# EAGLE design AVR-Timer_smd (EAGLE 7.4.0)
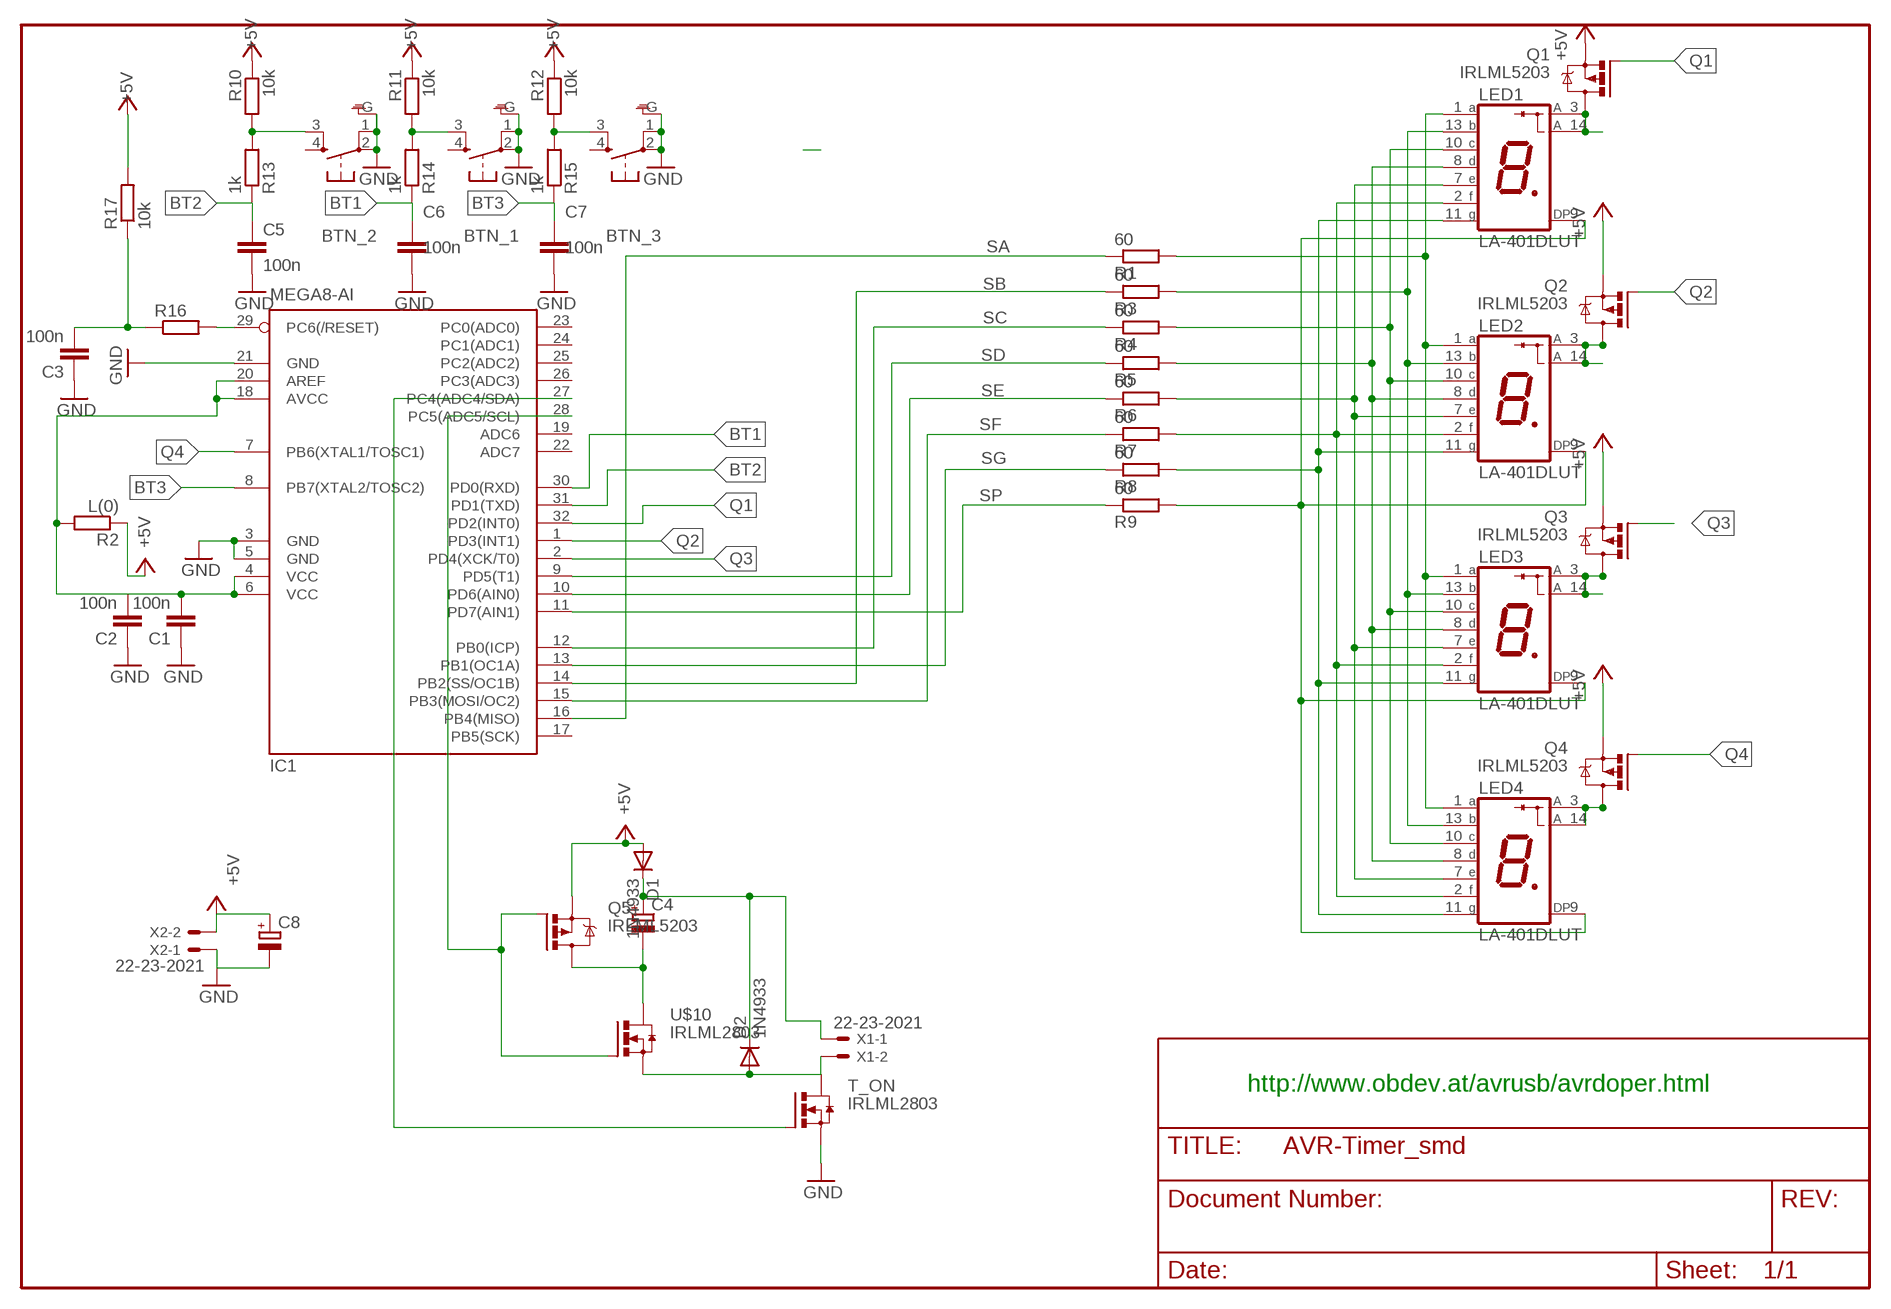
[diagram p0: schematic, sheet 1]

## Parts
BTN_1  10-XXG  [B3F-10XXG]
BTN_2  10-XXG  [B3F-10XXG]
BTN_3  10-XXG  [B3F-10XXG]
C1  100n  C-EUC0805K  [C0805K]
C2  100n  C-EUC0805K  [C0805K]
C3  100n  C-EUC0805K  [C0805K]
C4  CPOL-EUE5-8.5  [E5-8,5]
C5  100n  C-EUC0805K  [C0805K]
C6  100n  C-EUC0805K  [C0805K]
C7  100n  C-EUC0805K  [C0805K]
C8  CPOL-EUE5-8.5  [E5-8,5]
D1  1N4933  [DO41-10]
D2  1N4933  [DO41-10]
IC1  MEGA8-AI  [TQFP32-08]
LED1  LA-401DLUT  [MY_LUT]
LED2  LA-401DLUT  [MY_LUT]
LED3  LA-401DLUT  [MY_LUT]
LED4  LA-401DLUT  [MY_LUT]
Q1  IRLML5203  [MICRO3]
Q2  IRLML5203  [MICRO3]
Q3  IRLML5203  [MICRO3]
Q4  IRLML5203  [MICRO3]
Q5  IRLML5203  [MICRO3]
R1  60  R-EU_M0805  [M0805]
R2  L(0)  R-EU_M1206  [M1206]
R3  60  R-EU_M0805  [M0805]
R4  60  R-EU_M0805  [M0805]
R5  60  R-EU_M0805  [M0805]
R6  60  R-EU_M0805  [M0805]
R7  60  R-EU_M0805  [M0805]
R8  60  R-EU_M0805  [M0805]
R9  60  R-EU_M0805  [M0805]
R10  10k  R-EU_M0805  [M0805]
R11  10k  R-EU_M0805  [M0805]
R12  10k  R-EU_M0805  [M0805]
R13  1k  R-EU_M0805  [M0805]
R14  1k  R-EU_M0805  [M0805]
R15  1k  R-EU_M0805  [M0805]
R16  R-EU_M1206  [M1206]
R17  10k  R-EU_M1206  [M1206]
T_ON  IRLML2803  [SUPER-SOT3]
U$10  IRLML2803  [SUPER-SOT3]
X1  22-23-2021  [22-23-2021]
X2  22-23-2021  [22-23-2021]

## Nets
+5V: C8.+ D1.A Q1.2(S) Q2.2(S) Q3.2(S) Q4.2(S) Q5.2(S) R2.1 R10.1 R11.1 R12.1 R17.2 X2.2
BT1: C6.1 IC1.30(PD0(RXD)) R14.1
BT2: C5.1 IC1.31(PD1(TXD)) R13.1
BT3: C7.1 IC1.8(PB7(XTAL2/TOSC2)) R15.1
GND: BTN_1.1 BTN_1.2(P) BTN_1.G(GND) BTN_2.1 BTN_2.2(P) BTN_2.G(GND) BTN_3.1 BTN_3.2(P) BTN_3.G(GND) C1.1 C2.1 C3.1 C5.2 C6.2 C7.2 C8.- IC1.3(GND) IC1.5(GND) IC1.21(GND) T_ON.2(S) X2.1
N$3: C1.2 C2.2 IC1.4(VCC) IC1.6(VCC) IC1.18(AVCC) IC1.20(AREF) R2.2
N$5: BTN_2.3(S1) R10.2 R13.2
N$6: BTN_1.3(S1) R11.2 R14.2
N$7: BTN_3.3(S1) R12.2 R15.2
N$8: C3.2 R16.1 R17.1
N$9: LED1.1(A) LED2.1(A) LED3.1(A) LED4.1(A) R1.2
N$10: LED1.13(B) LED2.13(B) LED3.13(B) LED4.13(B) R3.2
N$11: LED1.10(C) LED2.10(C) LED3.10(C) LED4.10(C) R4.2
N$12: LED1.8(D) LED2.8(D) LED3.8(D) LED4.8(D) R5.2
N$13: LED1.7(E) LED2.7(E) LED3.7(E) LED4.7(E) R6.2
N$14: LED1.9(DP) LED2.9(DP) LED3.9(DP) LED4.9(DP) R9.2
N$15: LED1.11(G) LED2.11(G) LED3.11(G) LED4.11(G) R8.2
N$16: LED3.3(A) LED3.14(A) Q3.3(D)
N$17: LED2.3(A) LED2.14(A) Q2.3(D)
N$18: LED4.3(A) LED4.14(A) Q4.3(D)
N$19: LED1.2(F) LED2.2(F) LED3.2(F) LED4.2(F) R7.2
N$20: LED1.3(A) LED1.14(A) Q1.3(D)
N$21: C4.- Q5.3(D) U$10.3(D)
N$22: IC1.28(PC5(ADC5/SCL)) Q5.1(G) U$10.1(G)
N$23: D2.A T_ON.3(D) U$10.2(S) X1.2
N$24: C4.+ D1.C D2.C X1.1
N$25: IC1.27(PC4(ADC4/SDA)) T_ON.1(G)
Q1: IC1.32(PD2(INT0)) Q1.1(G)
Q2: IC1.1(PD3(INT1)) Q2.1(G)
Q3: IC1.2(PD4(XCK/T0)) Q3.1(G)
Q4: IC1.7(PB6(XTAL1/TOSC1)) Q4.1(G)
RESET: IC1.29(PC6(/RESET)) R16.2
SA: IC1.16(PB4(MISO)) R1.1
SB: IC1.14(PB2(SS/OC1B)) R3.1
SC: IC1.12(PB0(ICP)) R4.1
SD: IC1.9(PD5(T1)) R5.1
SE: IC1.10(PD6(AIN0)) R6.1
SF: IC1.15(PB3(MOSI/OC2)) R7.1
SG: IC1.13(PB1(OC1A)) R8.1
SP: IC1.11(PD7(AIN1)) R9.1
Unconnected: BTN_1.4(S) BTN_2.4(S) BTN_3.4(S) IC1.17(PB5(SCK)) IC1.19(ADC6) IC1.22(ADC7) IC1.23(PC0(ADC0)) IC1.24(PC1(ADC1)) IC1.25(PC2(ADC2)) IC1.26(PC3(ADC3))

## Notes on the sheet
- http://www.obdev.at/avrusb/avrdoper.html

## Library data of the parts
BTN_1-BTN_3 = switch-omron:10-XXG
C1-C3 C5-C7 = resistor:C-EU: CAPACITOR, European symbol
C4 C8 = resistor:CPOL-EU: POLARIZED CAPACITOR, European symbol
D1 D2 = diode:1N4933: DIODE fast recovery rectifier, 1A
IC1 = atmel:MEGA8: MICROCONTROLLER 8 Kbytes FLASH, 1 kbytes SRAM, 512 bytes EEPROM, USART, 6-channel 10 bit ADC, 2-channel 8 bit ADC Pin compatible with Atmega48, ATMega88, ATMega168 Source: avr.lbr
LED1-LED4 = led-7-segment_my:LA-401*D: Single Digit LED Numeric Display (anode common) Source: ROHM .. la-1401dn.pdf
Q1-Q5 = transistor-power:IRLML5203: HEXFET P-Channel Power MOSFET
R1-R17 = resistor:R-EU_: RESISTOR, European symbol
T_ON U$10 = transistor-power:IRLML2803
X1 X2 = con-molex:22-23-2021: .100" (2.54mm) Center Header - 2 Pin; MF: MOLEX; MPN: 22-23-2021; OC_FARNELL: 1462926; OC_NEWARK: 25C3832

## Board
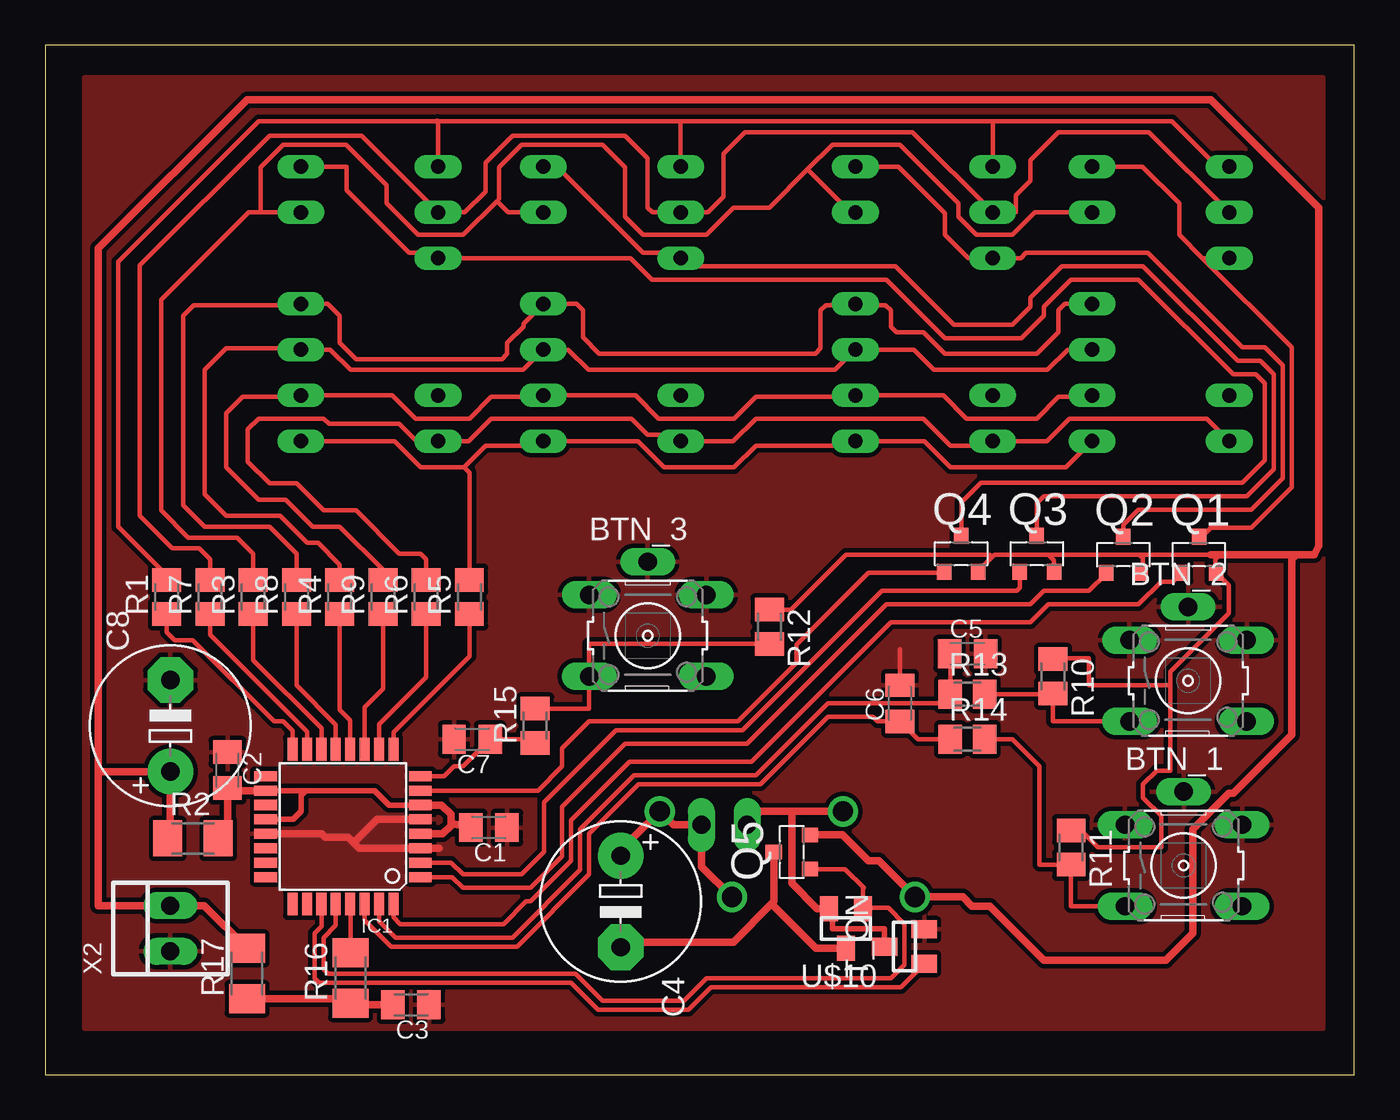
[diagram p1: board, top side]
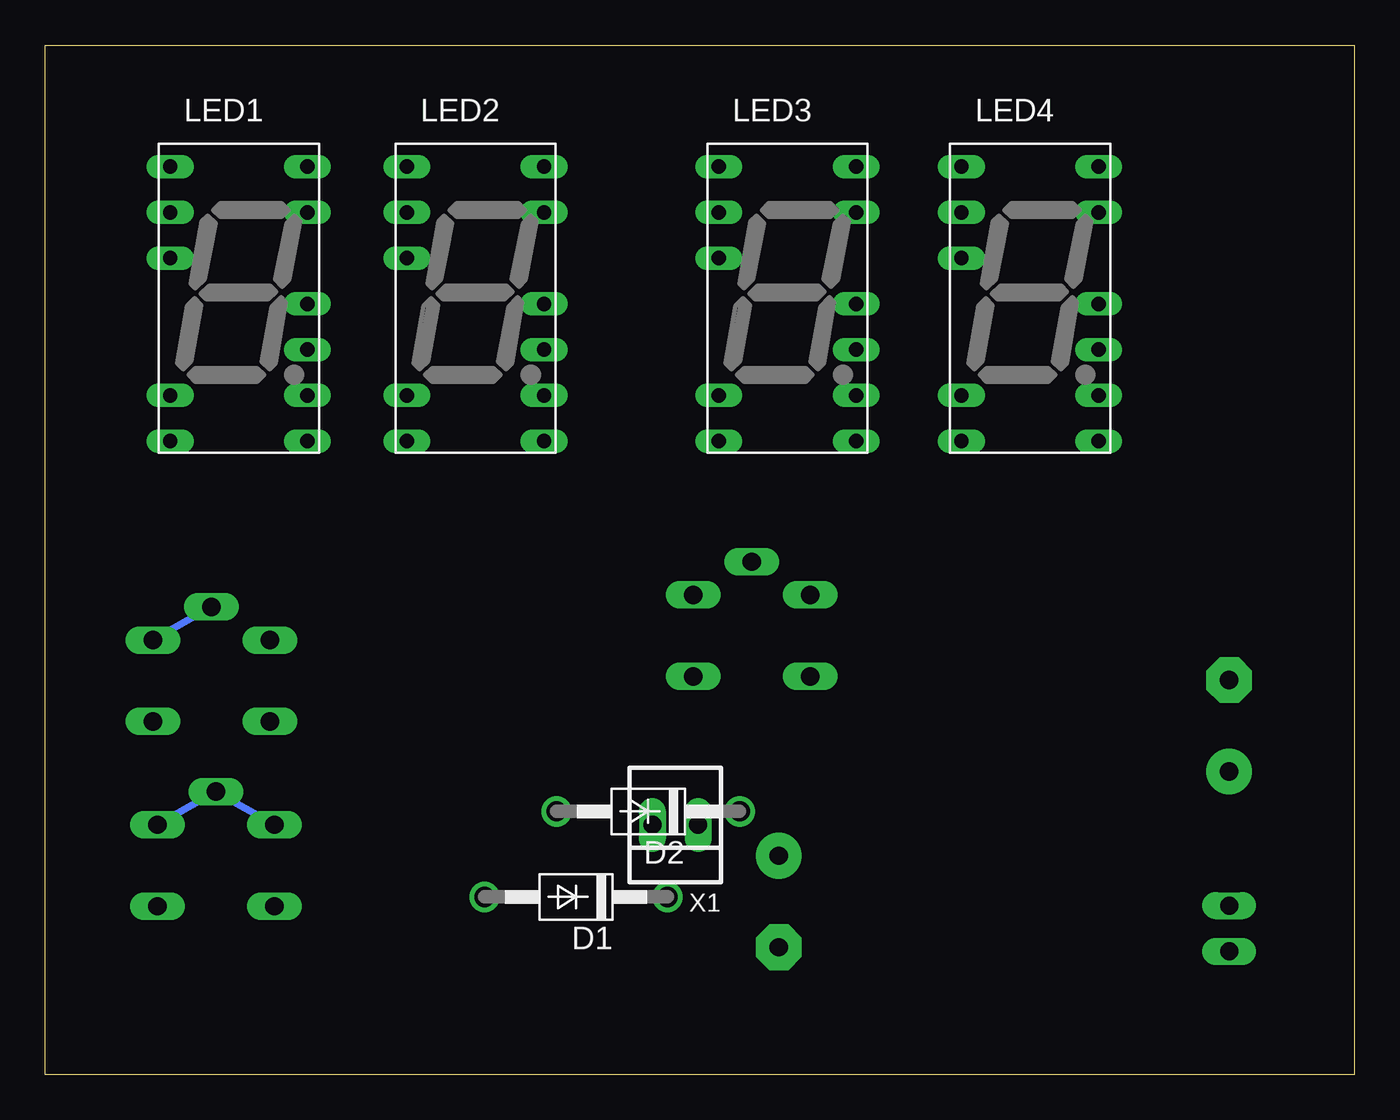
[diagram p2: board, bottom side, seen from below]

Size 72.69 x 57.14 mm. Coordinates in mm from the lower left corner, seen from the top.
Outline: 0,0 72.69,0 72.69,57.14 0,57.14 0,0
Copper layers (1+16): Top 0.0178mm / dielectric 1.5011mm / Bottom 0.0178mm
Design rules "default": minimum track width 0.2mm, minimum drill 0.3mm, track to track 0.2mm, track to pad 0.2mm, pad to pad 0.2mm, via to via 0.2mm, smd to smd 0mil, copper to edge 0.25mm, drill to drill 0.2mm, minimum pad ring 10mil, minimum via ring 8mil, stop-mask expansion 4mil, vias tented up to drill 0.5mm, thermal gap 10mil

### Footprints (pad centres in the part's own frame; a part is rotated, then mirrored left to right if it is on the bottom)
B3F-10XXG = drill 1.016 long: 1 -3.251,2.261; 2 3.251,2.261; 3 -3.251,-2.261; 4 3.251,-2.261; G 0,4.1
C0805K = smd 1.3 x 1.6: 1 -1,0; 2 1,0
E5-8,5 = drill 1.016 pad 2.54: + -2.54,0 | drill 1.016 pad 2.54 octagon: - 2.54,0
DO41-10 = drill 1.118: A 5.08,0; C -5.08,0
TQFP32-08 = smd 1.27 x 0.559: 1 -4.293,2.8; 2 -4.293,2; 3 -4.293,1.2; 4 -4.293,0.4; 5 -4.293,-0.4; 6 -4.293,-1.2; 7 -4.293,-2; 8 -4.293,-2.8; 17 4.293,-2.8; 18 4.293,-2; 19 4.293,-1.2; 20 4.293,-0.4; 21 4.293,0.4; 22 4.293,1.2; 23 4.293,2; 24 4.293,2.8 | smd 0.559 x 1.27: 9 -2.8,-4.293; 10 -2,-4.293; 11 -1.2,-4.293; 12 -0.4,-4.293; 13 0.4,-4.293; 14 1.2,-4.293; 15 2,-4.293; 16 2.8,-4.293; 25 2.8,4.293; 26 2,4.293; 27 1.2,4.293; 28 0.4,4.293; 29 -0.4,4.293; 30 -1.2,4.293; 31 -2,4.293; 32 -2.8,4.293
MY_LUT = drill 0.8 long: 1 -3.81,6.35; 2 -3.81,3.81; 3 -3.81,1.27; 6 -3.81,-6.35; 7 -3.81,-8.89; 8 3.81,-8.89; 9 3.81,-6.35; 10 3.81,-3.81; 11 3.81,-1.27; 13 3.81,3.81; 14 3.81,6.35
MICRO3 = smd 0.8 x 0.9: 1 -0.95,-1; 2 0.95,-1; 3 0,1
M0805 = smd 1.3 x 1.6: 1 -0.95,0; 2 0.95,0
M1206 = smd 1.6 x 2: 1 -1.4,0; 2 1.4,0
SUPER-SOT3 = smd 1 x 1.4: 1 -0.95,-1.1; 2 0.95,-1.1; 3 0,1.1
22-23-2021 = drill 1 long: 1 -1.27,0; 2 1.27,0

### Placement (x,y rotation side)
BTN_1  63.21,11.61 0 top
BTN_2  63.46,21.86 0 top
BTN_3  33.46,24.36 0 top
C1  24.64,13.72 180 top
C2  10.13,16.9 270 top
C3  20.32,3.88 180 top
C4  31.96,9.61 270 top
C5  51.21,23.36 0 top
C6  47.46,20.61 90 top
C7  23.71,18.61 180 top
C8  6.96,19.36 90 top
D1  43.21,9.86 180 bottom
D2  39.21,14.61 180 bottom
IC1  16.54,13.76 180 top
LED1  61.93,44.05 0 bottom
LED2  48.8,44.05 0 bottom
LED3  31.48,44.05 0 bottom
LED4  18.01,44.05 0 bottom
Q1  64.06,28.86 0 top
Q2  59.86,28.86 0 top
Q3  55.06,28.91 0 top
Q4  50.86,28.91 0 top
Q5  41.46,12.36 90 top
R1  6.76,26.51 90 top
R2  8.21,13.11 0 top
R3  11.56,26.51 90 top
R4  16.36,26.51 90 top
R5  23.56,26.51 90 top
R6  21.16,26.51 90 top
R7  9.16,26.51 90 top
R8  13.96,26.51 90 top
R9  18.76,26.51 90 top
R10  55.96,22.11 270 top
R11  56.96,12.61 270 top
R12  40.21,24.86 270 top
R13  51.21,21.11 0 top
R14  51.21,18.61 0 top
R15  27.21,19.36 90 top
R16  16.96,5.36 90 top
R17  11.21,5.61 90 top
T_ON  47.71,7.11 90 top
U$10  44.46,8.11 180 top
X1  37.71,13.86 180 bottom
X2  6.96,8.11 90 top

### Tracks (layer width: path | path; a pad name or v marks a point on that pad's centre or on a via)
+5V
  Top 0.25: Q4.2 51.81,27.96 52.59,28.73 | 52.59,28.73 52.71,28.86 55.71,28.86 | 55.71,28.86 60.71,28.86 | 60.71,28.86 60.96,28.86 | 60.96,28.86 64.71,28.86 | 60.81,28.76 60.71,28.86 | 55.71,28.86 56.01,28.56 Q3.2 | 62.46,21.61 62.46,16.86 61.71,16.86 60.96,16.11 60.96,15.36 61.96,14.36 61.96,12.61 58.46,12.61 57.71,13.36 57.21,13.36 56.96,13.61 | 62.46,21.61 57.96,21.61 57.96,23.11 55.96,23.11 R10.1 | R12.1 41.41,25.81 44.46,28.86 52.46,28.86 52.59,28.73 | Q2.2 60.96,28.01 60.96,28.86 | 62.46,21.61 62.46,22.36 65.71,25.61 65.71,27.16 Q1.2 64.96,27.91 64.96,28.61 65.21,28.86
  Top 0.406: 64.71,28.86 65.21,28.86 69.46,28.86 | 69.46,28.86 70.46,28.86 70.71,29.36 70.71,48.11 64.71,54.11 11.21,54.11 2.96,45.86 2.96,16.82 | Q5.2 44.26,13.31 45.71,11.86 46.29,11.86 D1.A 50.96,9.86 51.46,9.36 52.46,9.36 55.46,6.36 62.21,6.36 63.71,7.86 63.71,13.61 65.71,15.61 65.96,15.61 69.21,18.86 69.21,28.61 69.46,28.86 | R11.1 56.96,13.61 57.21,13.86 | R17.2 8.84,9.38 X2.2 2.96,9.38 2.96,16.82 | 2.96,16.82 C8.+ 6.96,13.26 R2.1
BT1
  Top 0.25: IC1.30 17.74,8.58 19.21,7.11 26.21,7.11 30.21,11.11 30.21,13.36 32.96,16.11 39.71,16.11 43.46,19.86 45.96,19.86 46.21,19.61 C6.1 48.46,18.61 R14.1
BT2
  Top 0.25: C5.1 50.26,22.86 R13.1 49.76,20.61 43.46,20.61 39.46,16.61 32.71,16.61 29.71,13.61 29.71,11.36 25.96,7.61 19.46,7.61 18.54,8.53 IC1.31
BT3
  Top 0.25: R15.1 27.21,18.61 C7.1 23.21,17.11 22.71,17.11 22.16,16.56 IC1.8
GND
  Top 0.25: C6.2 47.46,23.61
  Top 0.406: 21.87,12.56 IC1.3 17.43,12.56 17.13,12.86 | 17.13,12.86 16.82,13.18 15.55,13.18 15.36,13.36 IC1.21 | IC1.5 18.44,14.16 17.13,12.86
  Bottom 0.406: BTN_1.1 BTN_1.G BTN_1.2 | BTN_2.G BTN_2.2
  pour Top (isolate 0.25): 2.17,55.34 70.96,55.34 70.96,2.54 2.17,2.54
N$3
  Top 0.3: IC1.18 14.46,15.76 | 14.46,15.76 18.31,15.76 19.11,14.96 IC1.6 | IC1.20 13.76,14.16 14.21,14.61 14.21,15.51 14.46,15.76
  Top 0.406: IC1.6 22.01,14.96 22.53,14.45 22.53,13.81 | IC1.4 22.08,13.36 22.53,13.81 | C1.2 22.65,13.93 22.53,13.81 | R2.2 10.13,13.11 C2.2 10.13,15.76 IC1.18
N$5
  Top 0.25: R13.2 55.96,21.11 R10.2 55.96,19.6 BTN_2.3
N$6
  Top 0.25: BTN_1.3 56.96,9.35 R11.2 55.21,11.66 55.21,17.11 53.71,18.61 R14.2
N$7
  Top 0.25: R12.2 30.21,23.91 BTN_3.3 30.21,20.31 R15.2
N$8
  Top 0.406: C3.2 17.05,3.88 R16.1 16.73,3.72 16.24,4.21 R17.1
N$9
  Top 0.25: LED1.1 65.07,50.39 62.56,52.91 52.61,52.91 | R1.2 6.76,27.71 4.06,30.41 4.06,45.11 11.86,52.91 21.76,52.91 35.29,52.91 | 52.61,52.91 35.29,52.91 | LED4.1 21.82,52.85 | LED3.1 35.29,52.91 | LED2.1 52.61,52.91
  Top 0.3: 21.82,52.85 21.76,52.91
N$10
  Top 0.25: R3.2 11.56,28.91 10.66,29.81 7.96,29.81 6.46,31.31 6.46,43.01 11.3,47.85 LED4.13 11.96,47.85 11.96,47.86 11.96,50.36 13.21,51.61 16.71,51.61 18.96,49.36 18.96,48.36 20.71,46.61 23.21,46.61 25.09,48.48 | 25.09,48.48 25.21,48.61 25.21,50.36 26.46,51.61 30.96,51.61 32.21,50.36 32.21,47.61 33.21,46.61 36.71,46.61 38.21,48.11 40.21,48.11 42.34,50.23 | LED3.13 25.71,47.85 25.09,48.48 | 42.34,50.23 43.71,51.61 47.46,51.61 50.71,48.36 50.71,47.61 51.71,46.61 53.71,46.61 54.95,47.85 LED1.13 | LED2.13 44.72,47.85 42.34,50.23
N$11
  Top 0.25: 16.36,27.41 R4.2 16.36,28.31 15.16,29.51 14.56,29.51 13.06,31.01 10.06,31.01 8.86,32.21 8.86,39.11 10.06,40.31 14.12,40.31 LED4.10 15.84,40.23 16.96,39.11 26.55,39.11 LED3.10 29.04,40.23 30.16,39.11 43.87,39.11 LED2.10 48.23,40.23 49.36,39.11 55.66,39.11 56.79,40.23 LED1.10
N$12
  Top 0.25: LED4.8 19.41,35.16 20.86,33.71 23.26,33.71 | 23.26,33.71 24.46,34.91 27.43,34.91 LED3.8 32.91,35.16 34.36,33.71 38.26,33.71 39.46,34.91 44.74,34.91 LED2.8 48.81,35.16 50.26,33.71 56.68,33.71 LED1.8 | R5.2 23.56,33.41 23.26,33.71
N$13
  Top 0.25: LED1.7 64.49,36.41 56.86,36.41 55.61,35.16 LED2.7 | 21.16,27.71 R6.2 21.16,28.61 20.86,28.91 19.66,28.91 17.26,31.31 15.46,31.31 13.96,32.81 12.46,32.81 11.26,34.01 11.26,35.81 11.86,36.41 15.46,36.41 15.76,36.11 19.66,36.11 20.62,35.16 LED4.7 23.51,35.16 24.76,36.41 32.56,36.41 33.46,35.51 34.96,35.51 35.26,35.21 35.26,35.19 LED3.7 38.2,35.16 39.46,36.41 48.76,36.41 50.26,34.91 52.36,34.91 LED2.7 | 52.66,35.21 LED2.7
N$14
  Top 0.25: R9.2 18.76,28.01 16.36,30.41 14.86,30.41 13.36,31.91 11.86,31.91 10.06,33.71 10.06,36.71 10.96,37.61 14.12,37.61 LED4.9 19.28,37.7 20.56,36.41 23.56,36.41 24.76,37.61 27.59,37.61 LED3.9 32.77,37.7 34.06,36.41 38.26,36.41 39.46,37.61 44.91,37.61 LED2.9 49.88,37.7 51.16,36.41 55.06,36.41 56.26,37.61 58.04,37.61 LED1.9
N$15
  Top 0.25: R8.2 13.96,28.91 12.46,30.41 8.86,30.41 7.66,31.61 7.66,42.11 8.26,42.71 14.14,42.71 LED4.11 15.7,42.77 16.36,42.11 16.36,40.61 17.26,39.71 25.36,39.71 25.66,40.01 25.66,40.61 26.56,41.51 26.56,41.66 LED3.11 29.49,42.77 29.86,42.41 29.86,40.91 30.76,40.01 42.76,40.01 43.06,40.31 43.06,42.41 43.36,42.71 45.05,42.71 | LED1.11 56.62,42.77 56.26,42.41 56.26,41.21 55.06,40.01 49.96,40.01 48.76,41.21 47.26,41.21 46.96,41.51 46.96,42.41 46.66,42.71 45.16,42.71 | 45.16,42.71 45.05,42.71 | 45.05,42.71 LED2.11 45.09,42.77 45.16,42.71
N$16
  Top 0.25: LED3.14 28.43,50.39 33.21,45.61 34.99,45.61 LED3.3 35.74,44.86 47.21,44.86 50.46,41.61 53.71,41.61 54.71,42.61 54.71,43.11 56.46,44.86 60.96,44.86 66.21,39.61 67.46,39.61 68.21,38.86 68.21,33.61 66.71,32.11 55.46,32.11 55.06,31.71 Q3.3
N$17
  Top 0.25: LED2.14 47.38,50.39 49.96,47.81 49.96,46.61 51.26,45.31 LED2.3 54.16,45.31 54.46,45.61 61.21,45.61 66.46,40.36 67.71,40.36 68.71,39.36 68.71,33.11 66.96,31.36 60.71,31.36 59.86,30.51 Q2.3
N$18
  Top 0.25: LED4.14 16.74,50.39 16.74,49.08 20.21,45.61 21.53,45.61 LED4.3 32.51,45.31 33.71,44.11 46.71,44.11 49.96,40.86 54.21,40.86 55.46,42.11 55.46,42.61 56.96,44.11 60.71,44.11 65.96,38.86 67.21,38.86 67.71,38.36 67.71,34.11 66.46,32.86 51.96,32.86 50.86,31.76 Q4.3
N$19
  Top 0.25: R7.2 9.16,28.61 8.56,29.21 7.06,29.21 5.26,31.01 5.26,44.91 12.46,52.11 17.57,52.11 LED4.2 23.3,47.85 24.46,49.01 24.46,50.61 25.96,52.11 32.21,52.11 33.46,50.86 33.46,48.11 33.72,47.85 LED3.2 36.8,47.85 37.66,48.71 37.66,51.11 38.86,52.31 48.16,52.31 LED2.2 53.91,47.85 53.91,48.8 54.71,49.61 54.71,50.76 56.26,52.31 61.29,52.31 LED1.2
N$20
  Top 0.25: LED1.14 60.93,50.39 62.96,48.36 62.96,46.61 64.25,45.31 | LED1.3 64.25,45.31 | 64.25,45.31 69.21,40.36 69.21,32.61 66.96,30.36 64.71,30.36 64.06,29.71 Q1.3
N$21
  Top 0.406: Q5.3 40.46,9.61 40.34,9.48 | 40.34,9.48 38.21,7.36 33,7.36 C4.- | U$10.3 42.81,7.01 40.34,9.48
N$22
  Top 0.25: Q5.1 44.41,11.41 45.46,10.36 45.41,10.31 U$10.1 | 45.46,9.26 46.81,9.26 47.71,8.36 47.71,6.11 46.96,5.36 36.71,5.36 35.71,4.36 35.46,4.11 30.96,4.11 29.46,5.61 15.71,5.61 15.46,5.86 15.46,7.61 16.14,8.29 IC1.28
  Top 0.406: U$10.1 45.46,9.26
N$23
  Top 0.3: 43.46,9.21 43.71,9.21 43.71,8.11 46.61,8.11 T_ON.3
  Top 0.406: X1.2 39.73,14.61 41.46,14.61 | D2.A 41.46,14.61 | U$10.2 43.46,9.21 42.86,9.21 41.46,10.61 41.46,14.61
N$24
  Top 0.406: D1.C 36.44,11.55 X1.1 34.88,13.86 D2.C 32.71,13.19 C4.+
N$25
  Top 0.25: IC1.27 15.34,8.24 14.96,7.86 14.96,5.36 15.21,5.11 29.21,5.11 30.71,3.61 35.71,3.61 36.96,4.86 47.51,4.86 T_ON.1
Q1
  Top 0.25: Q1.1 62.61,27.36 61.96,27.36 60.71,26.11 55.71,26.11 54.71,25.11 46.96,25.11 39.21,17.36 32.46,17.36 29.21,14.11 29.21,11.86 26.96,9.61 26.71,9.61 25.46,8.36 19.71,8.36 19.34,8.73 IC1.32
Q2
  Top 0.25: IC1.1 22.61,10.96 23.21,10.36 26.96,10.36 28.71,12.11 28.71,14.86 32.21,18.36 38.96,18.36 46.71,26.11 54.71,26.11 55.46,26.86 57.96,26.86 58.91,27.81 Q2.1
Q3
  Top 0.25: Q3.1 54.11,27.01 53.96,26.86 46.46,26.86 38.71,19.11 31.71,19.11 27.71,15.11 27.71,12.36 26.46,11.11 23.21,11.11 22.56,11.76 IC1.2
Q4
  Top 0.25: IC1.7 27.36,15.76 28.71,17.11 28.71,18.11 30.21,19.61 38.46,19.61 41.71,22.86 41.71,23.86 45.71,27.86 49.86,27.86 Q4.1
RESET
  Top 0.25: R16.2 16.96,9.46 IC1.29
SA
  Top 0.25: R1.1 6.76,24.56 7.21,24.11 8.21,24.11 12.71,19.61 13.21,19.61 13.74,19.08 IC1.16
SB
  Top 0.25: IC1.14 15.34,19.23 11.56,23.01 R3.1
SC
  Top 0.25: IC1.12 16.94,19.68 16.36,20.26 R4.1
SD
  Top 0.25: IC1.9 19.34,18.99 20.21,19.86 20.46,20.11 23.56,23.21 R5.1
SE
  Top 0.25: IC1.10 18.54,19.44 21.16,22.06 R6.1
SF
  Top 0.25: IC1.15 14.54,19.03 9.16,24.41 R7.1
SG
  Top 0.25: IC1.13 16.14,19.43 13.96,21.61 R8.1
SP
  Top 0.25: IC1.11 17.74,20.39 18.59,21.23 18.71,21.36 18.76,21.41 R9.1